# Altium schematic sheet 11-RPi.SchDoc
size A
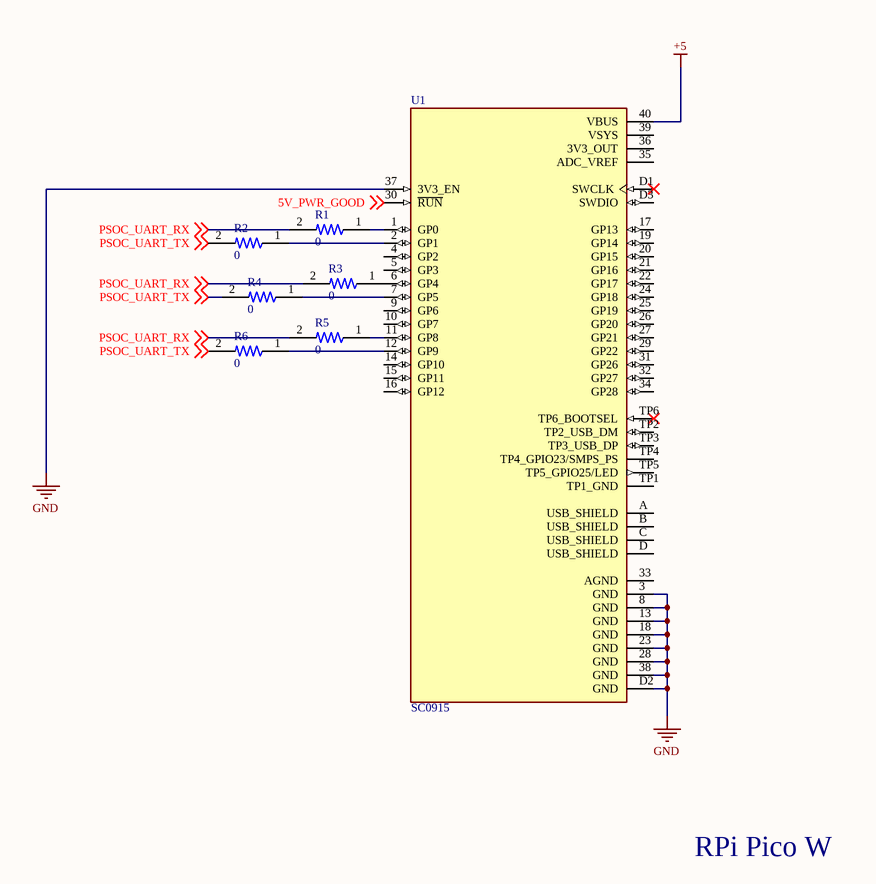
[diagram p0: 11-RPi.SchDoc]

## Parts
R1  0  [RESC2012X60N]
R2  0  [RESC2012X60N]
R3  0  [RESC2012X60N]
R4  0  [RESC2012X60N]
R5  0  [RESC2012X60N]
R6  0  [RESC2012X60N]
U1  SC0915  [MODULE_SC0915]

## Nets
+5: U1.40(VBUS)
GND: U1.3(GND) U1.8(GND) U1.13(GND) U1.18(GND) U1.23(GND) U1.28(GND) U1.37(3V3_EN) U1.38(GND) U1.D2(GND)
5V_PWR_GOOD: U1.30(~{RUN}) ; off-sheet 5V_PWR_GOOD
PSOC_UART_RX: R1.2 R3.2 R5.2 ; off-sheet PSOC_UART_RX
PSOC_UART_TX: R2.2 R4.2 R6.2 ; off-sheet PSOC_UART_TX
NetR1_1: R1.1 U1.1(GP0)
NetR2_1: R2.1 U1.2(GP1)
NetR3_1: R3.1 U1.6(GP4)
NetR4_1: R4.1 U1.7(GP5)
NetR5_1: R5.1 U1.11(GP8)
NetR6_1: R6.1 U1.12(GP9)

Not connected (* = marked no-connect by the designer): U1 4(GP2) 5(GP3) 9(GP6) 10(GP7) 14(GP10) 15(GP11) 16(GP12) 17(GP13) 19(GP14) 20(GP15) 21(GP16) 22(GP17) 24(GP18) 25(GP19) 26(GP20) 27(GP21) 29(GP22) 31(GP26) 32(GP27) 33(AGND) 34(GP28) 35(ADC_VREF) 36(3V3_OUT) 39(VSYS) A(USB_SHIELD) B(USB_SHIELD) C(USB_SHIELD) D(USB_SHIELD) D1(SWCLK)* D3(SWDIO) TP1(TP1_GND) TP2(TP2_USB_DM) TP3(TP3_USB_DP) TP4(TP4_GPIO23/SMPS_PS) TP5(TP5_GPIO25/LED) TP6(TP6_BOOTSEL)*

## Notes on the sheet
- RPi Pico W

## Library data of the parts
R1-R6 = RMCF0805ZT0R00: 0 Ohms Jumper 0.125W, 1/8W Chip Resistor 0805 (2012 Metric) Automotive AEC-Q200 Thick Film; MF: Stackpole Electronics; DigiKey-Purchase-URL: https://snapeda.com/shop?store=DigiKey&id=492501; Package: 0805 Stackpole Electronics; Availability: Unavailable; MP: RMCF0805ZT0R00; SnapEDA_Link: https://www.snapeda.com/parts/RMCF0805ZT0R00/Stackpole%20Electronics%20Inc/view-part/492501/?ref=snap; Price: None; Value: *
U1 = SC0915: RP2040 Raspberry Pi Pico - ARM Cortex-M0+ MCU 32-Bit Embedded Evaluation Board; Availability: Unavailable; Package: None; MP: SC0915; Value: *; Price: None